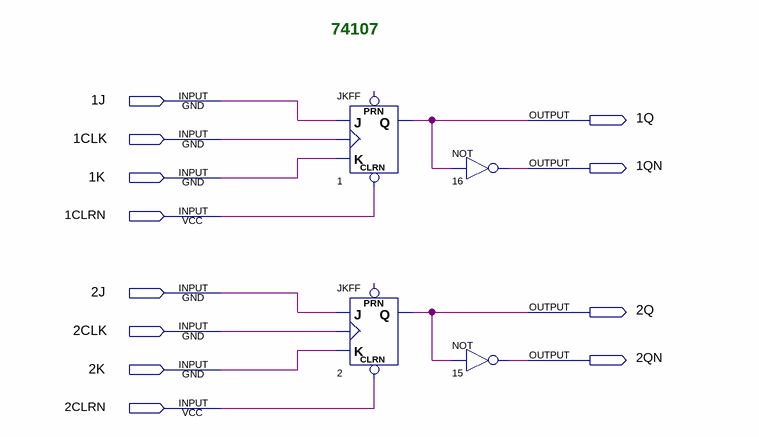
[diagram p0: schematic sheet]
// Quartus schematic 74107.bdf as structural Verilog: 4 symbols, 12 pins
module \74107  (
  input  \1J ,
  input  \1CLK ,
  input  \1K ,
  input  \1CLRN ,
  input  \2J ,
  input  \2CLK ,
  input  \2K ,
  input  \2CLRN ,
  output \1Q ,
  output \1QN ,
  output \2Q ,
  output \2QN 
);

  JKFF u_1 (.CLRN(\1CLRN ), .K(\1K ), .J(\1J ), .CLK(\1CLK ), .Q(\1Q ));  // open: PRN
  JKFF u_2 (.CLRN(\2CLRN ), .K(\2K ), .J(\2J ), .CLK(\2CLK ), .Q(\2Q ));  // open: PRN
  not u_16 (\1QN , \1Q );
  not u_15 (\2QN , \2Q );

  // Notes on the sheet:
  //   74107
endmodule
